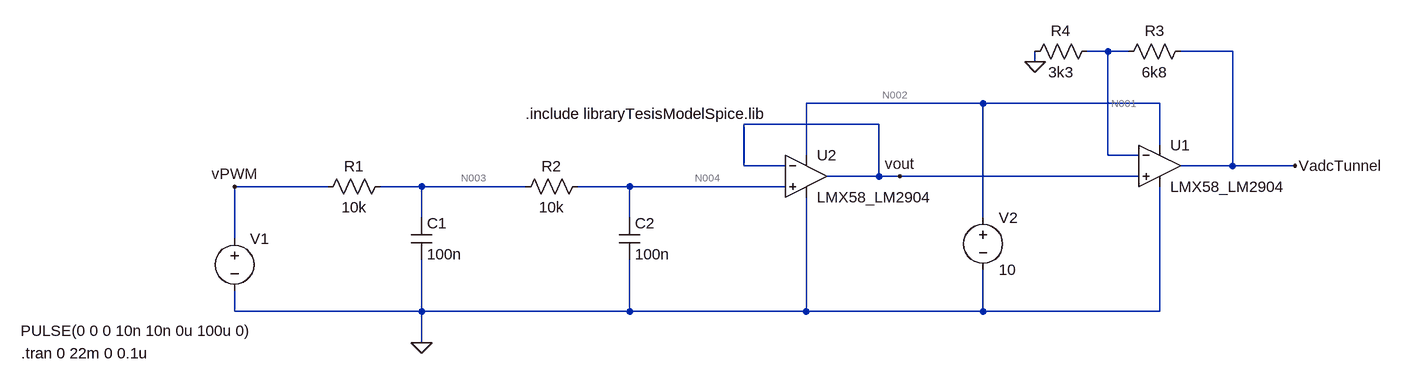
[diagram p0: schematic Version1CircuitoTensionTunnel.asc]
Version1CircuitoTensionTunnel.asc, the LTspice schematic file:
Version 4
SHEET 1 1032 680
WIRE 592 -128 560 -128
WIRE 624 -128 592 -128
WIRE 784 -128 704 -128
WIRE 480 -112 480 -128
WIRE 400 -48 128 -48
WIRE 672 -48 400 -48
WIRE 240 -16 32 -16
WIRE 672 16 672 -48
WIRE 128 32 128 -48
WIRE 592 32 592 -128
WIRE 640 32 592 32
WIRE 32 48 32 -16
WIRE 96 48 32 48
WIRE 784 48 784 -128
WIRE 784 48 704 48
WIRE 880 48 784 48
WIRE 240 64 240 -16
WIRE 240 64 160 64
WIRE 272 64 240 64
WIRE 640 64 272 64
WIRE -608 80 -752 80
WIRE -464 80 -528 80
WIRE -304 80 -464 80
WIRE -144 80 -224 80
WIRE 96 80 -144 80
WIRE -464 128 -464 80
WIRE -144 128 -144 80
WIRE 400 128 400 -48
WIRE -752 160 -752 80
WIRE -752 272 -752 240
WIRE -464 272 -464 192
WIRE -464 272 -752 272
WIRE -144 272 -144 192
WIRE -144 272 -464 272
WIRE 128 272 128 96
WIRE 128 272 -144 272
WIRE 400 272 400 208
WIRE 400 272 128 272
WIRE 672 272 672 80
WIRE 672 272 400 272
WIRE -464 320 -464 272
FLAG -752 80 vPWM
FLAG 272 64 vout
FLAG -464 320 0
FLAG 480 -112 0
FLAG 880 48 VadcTunnel
SYMBOL voltage -752 144 R0
WINDOW 123 0 0 Left 0
WINDOW 39 0 0 Left 0
WINDOW 3 -329 158 Left 2
SYMATTR Value PULSE(0 0 0 10n 10n 0u 100u 0)
SYMATTR InstName V1
SYMBOL res -512 64 R90
WINDOW 0 0 56 VBottom 2
WINDOW 3 32 56 VTop 2
SYMATTR InstName R1
SYMATTR Value 10k
SYMBOL cap -480 128 R0
SYMATTR InstName C1
SYMATTR Value 100n
SYMBOL voltage 400 112 R0
WINDOW 123 0 0 Left 0
WINDOW 39 0 0 Left 0
SYMATTR InstName V2
SYMATTR Value 10
SYMBOL res -208 64 R90
WINDOW 0 0 56 VBottom 2
WINDOW 3 32 56 VTop 2
SYMATTR InstName R2
SYMATTR Value 10k
SYMBOL cap -160 128 R0
SYMATTR InstName C2
SYMATTR Value 100n
SYMBOL res 720 -144 R90
WINDOW 0 0 56 VBottom 2
WINDOW 3 32 56 VTop 2
SYMATTR InstName R3
SYMATTR Value 6k8
SYMBOL res 576 -144 R90
WINDOW 0 0 56 VBottom 2
WINDOW 3 32 56 VTop 2
SYMATTR InstName R4
SYMATTR Value 3k3
SYMBOL OpAmps\\opamp2 128 0 R0
SYMATTR InstName U2
SYMATTR Value LMX58_LM2904
SYMBOL OpAmps\\opamp2 672 -16 R0
SYMATTR InstName U1
SYMATTR Value LMX58_LM2904
TEXT -1080 336 Left 2 !.tran 0 22m 0 0.1u
TEXT -304 -32 Left 2 !.include libraryTesisModelSpice.lib

The netlist it stands for:
* Version1CircuitoTensionTunnel.asc
V1 vPWM 0 PULSE(0 0 0 10n 10n 0u 100u 0)
R1 N003 vPWM 10k
C1 N003 0 100n
V2 N002 0 10
R2 N004 N003 10k
C2 N004 0 100n
R3 VadcTunnel N001 6k8
R4 N001 0 3k3
XU2 N004 vout N002 0 vout LMX58_LM2904  ; pins In+ In- V+ V- OUT
XU1 vout N001 N002 0 VadcTunnel LMX58_LM2904  ; pins In+ In- V+ V- OUT
.tran 0 22m 0 0.1u
.include libraryTesisModelSpice.lib
.backanno
.end

* Results of the author's LTspice run, read from the files saved beside the schematic
* Operating Point, zero values left out:
*   V(n003) = 200 µV
*   V(n002) = 10 V
*   V(n004) = 400.1 µV
*   V(vadctunnel) = 79.17 mV
*   V(n001) = 25.91 mV
*   V(vout) = 23.8 mV
*   I(R4) = 7.85 µA
*   I(R3) = 7.832 µA
*   I(R2) = 20.01 nA
*   I(R1) = 20.01 nA
*   I(V2) = -707.8 µA
*   I(V1) = 20.01 nA
*   Ix(u2:IN+) = -20.01 nA
*   Ix(u2:IN-) = -18 nA
*   Ix(u2:VCC) = 350 µA
*   Ix(u2:VEE) = -350 µA
*   Ix(u2:OUT) = 38.01 nA
*   Ix(u1:IN+) = -20 nA
*   Ix(u1:IN-) = -18 nA
*   Ix(u1:VCC) = 357.8 µA
*   Ix(u1:VEE) = -350 µA
*   Ix(u1:OUT) = -7.832 µA